# EasyEDA Pro project ProProject_阵列式磁场检测仪_2024-06-02.epro, schematic Schematic2

## Sheets
1 P1: Create Date: 2024-04-23; Page Name: P1; Project Name: 阵列式磁场检测仪; Schematic Name: Schematic2; Update Date: 2024-04-23; Company: 嘉立创EDA; Page Size: A4; Version: V1.0
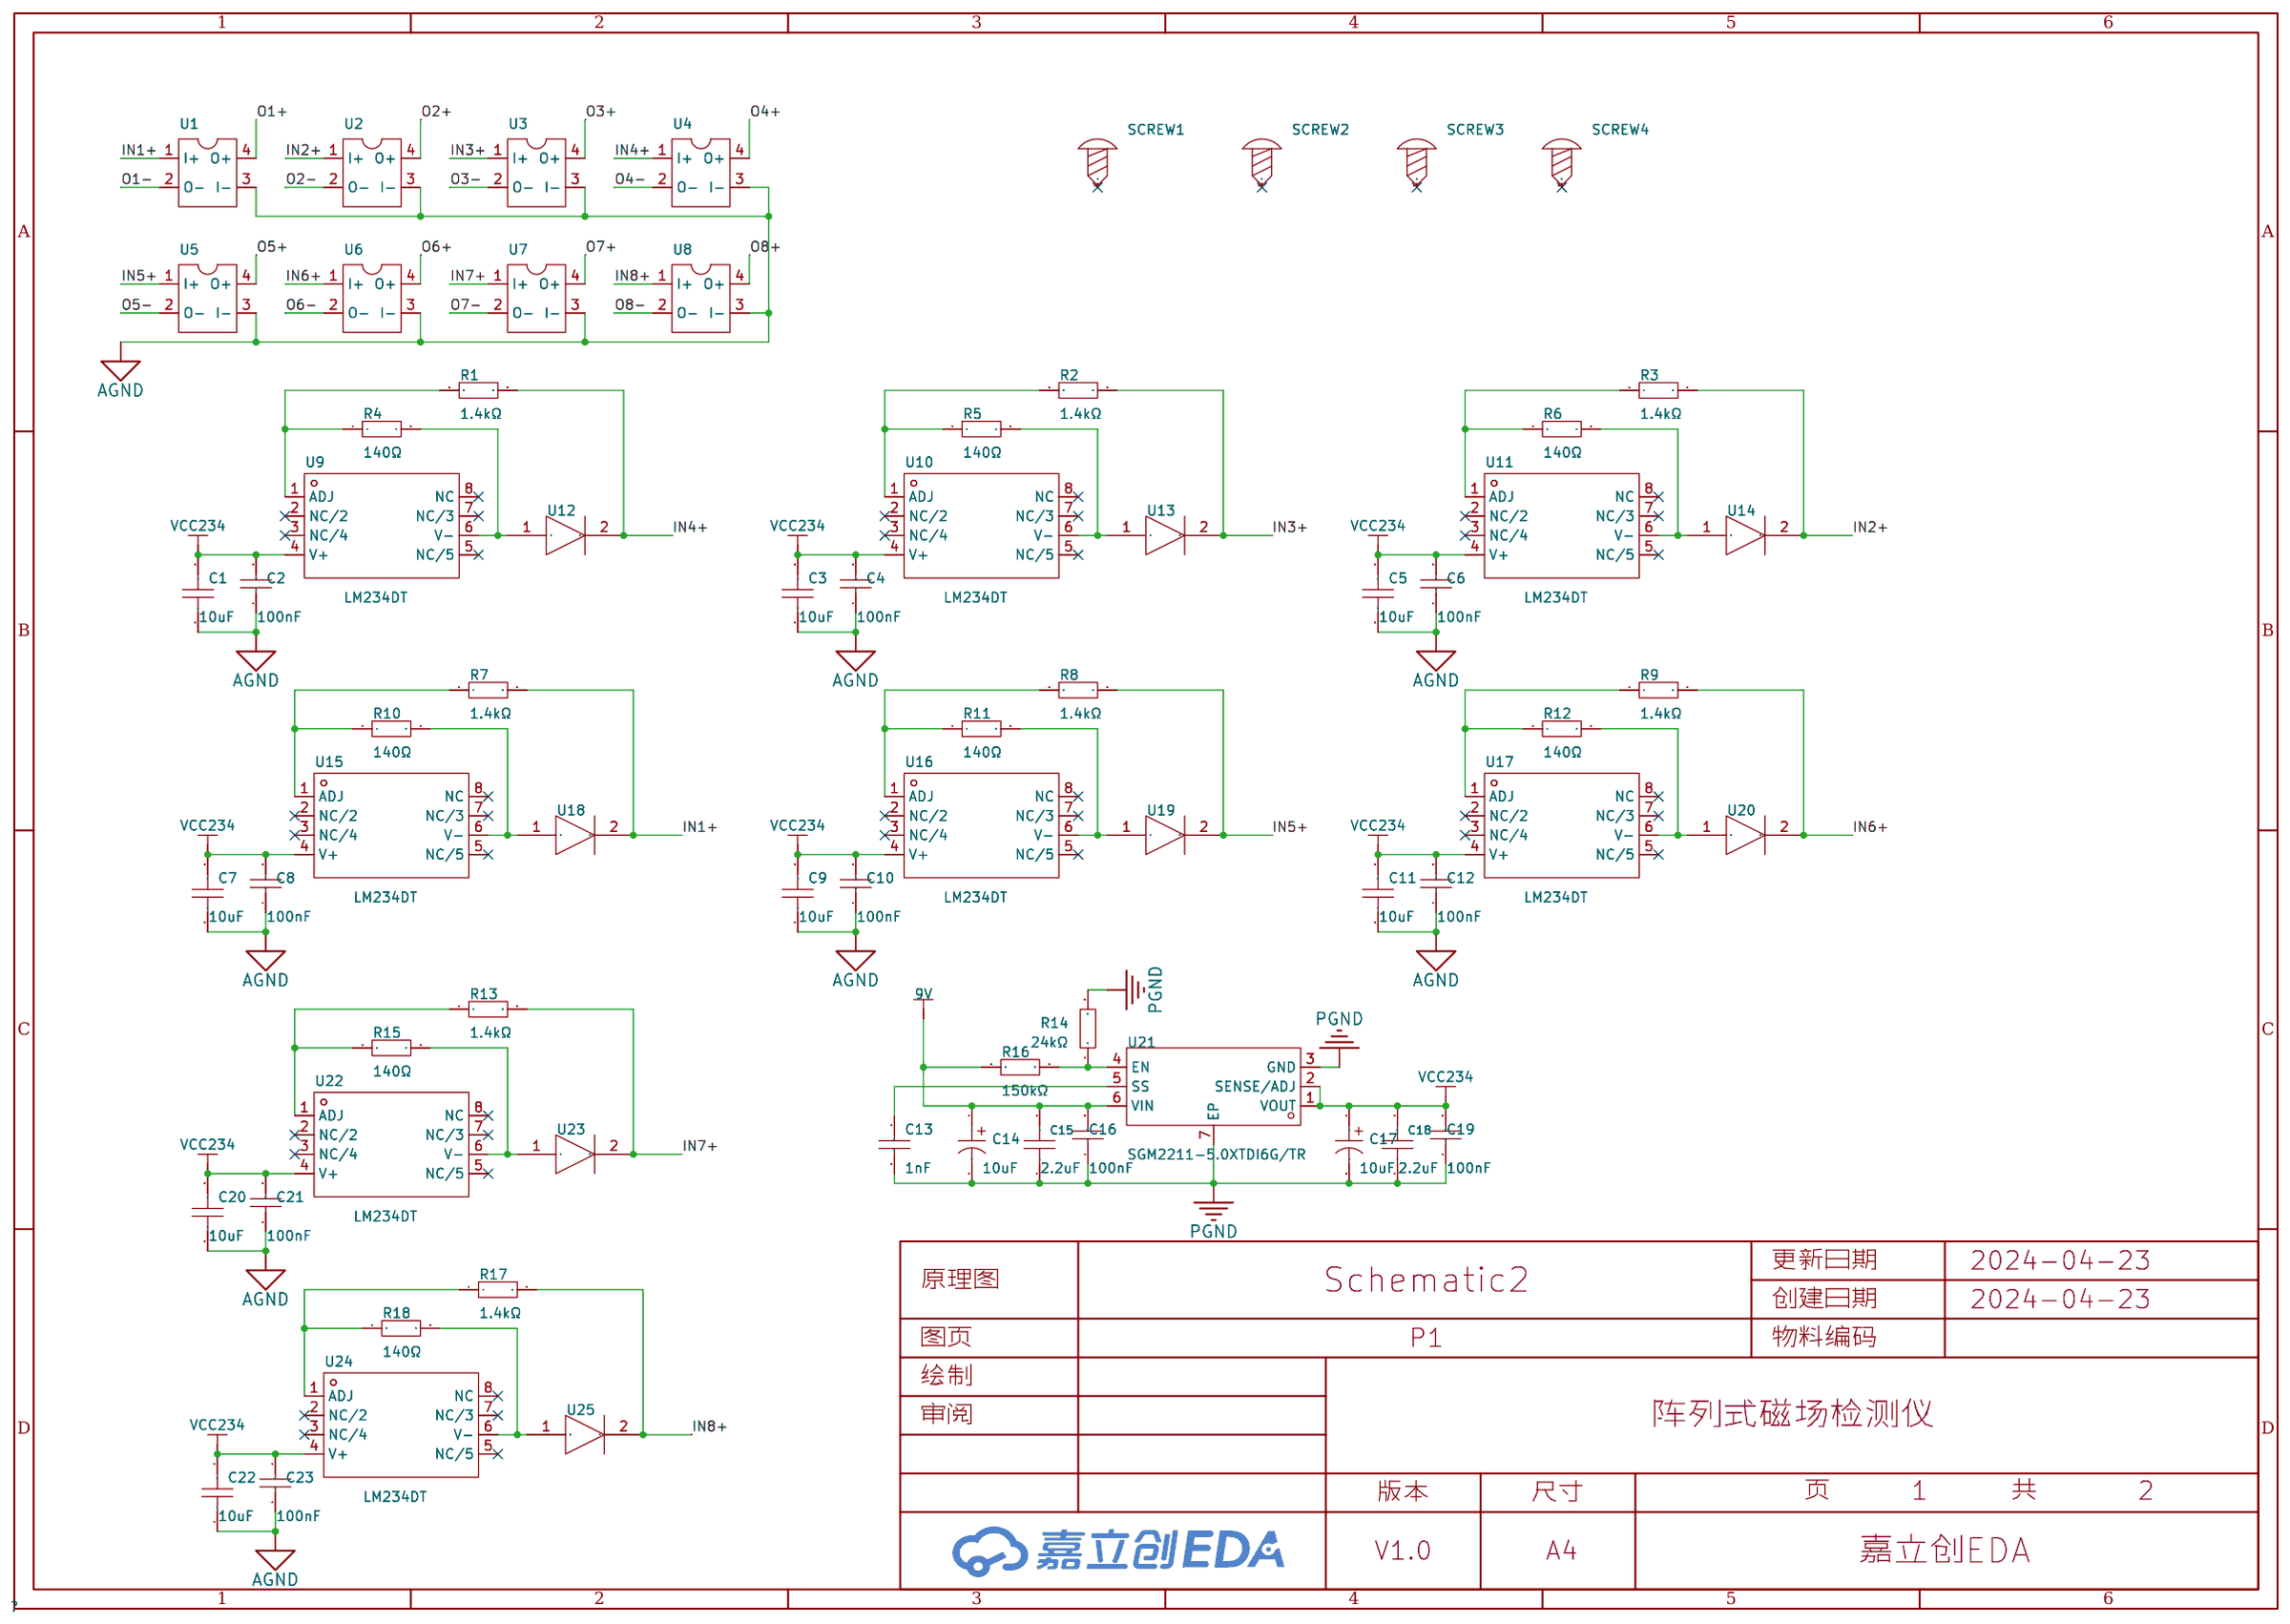
[diagram p1: P1]
2 P2: Page Name: P2
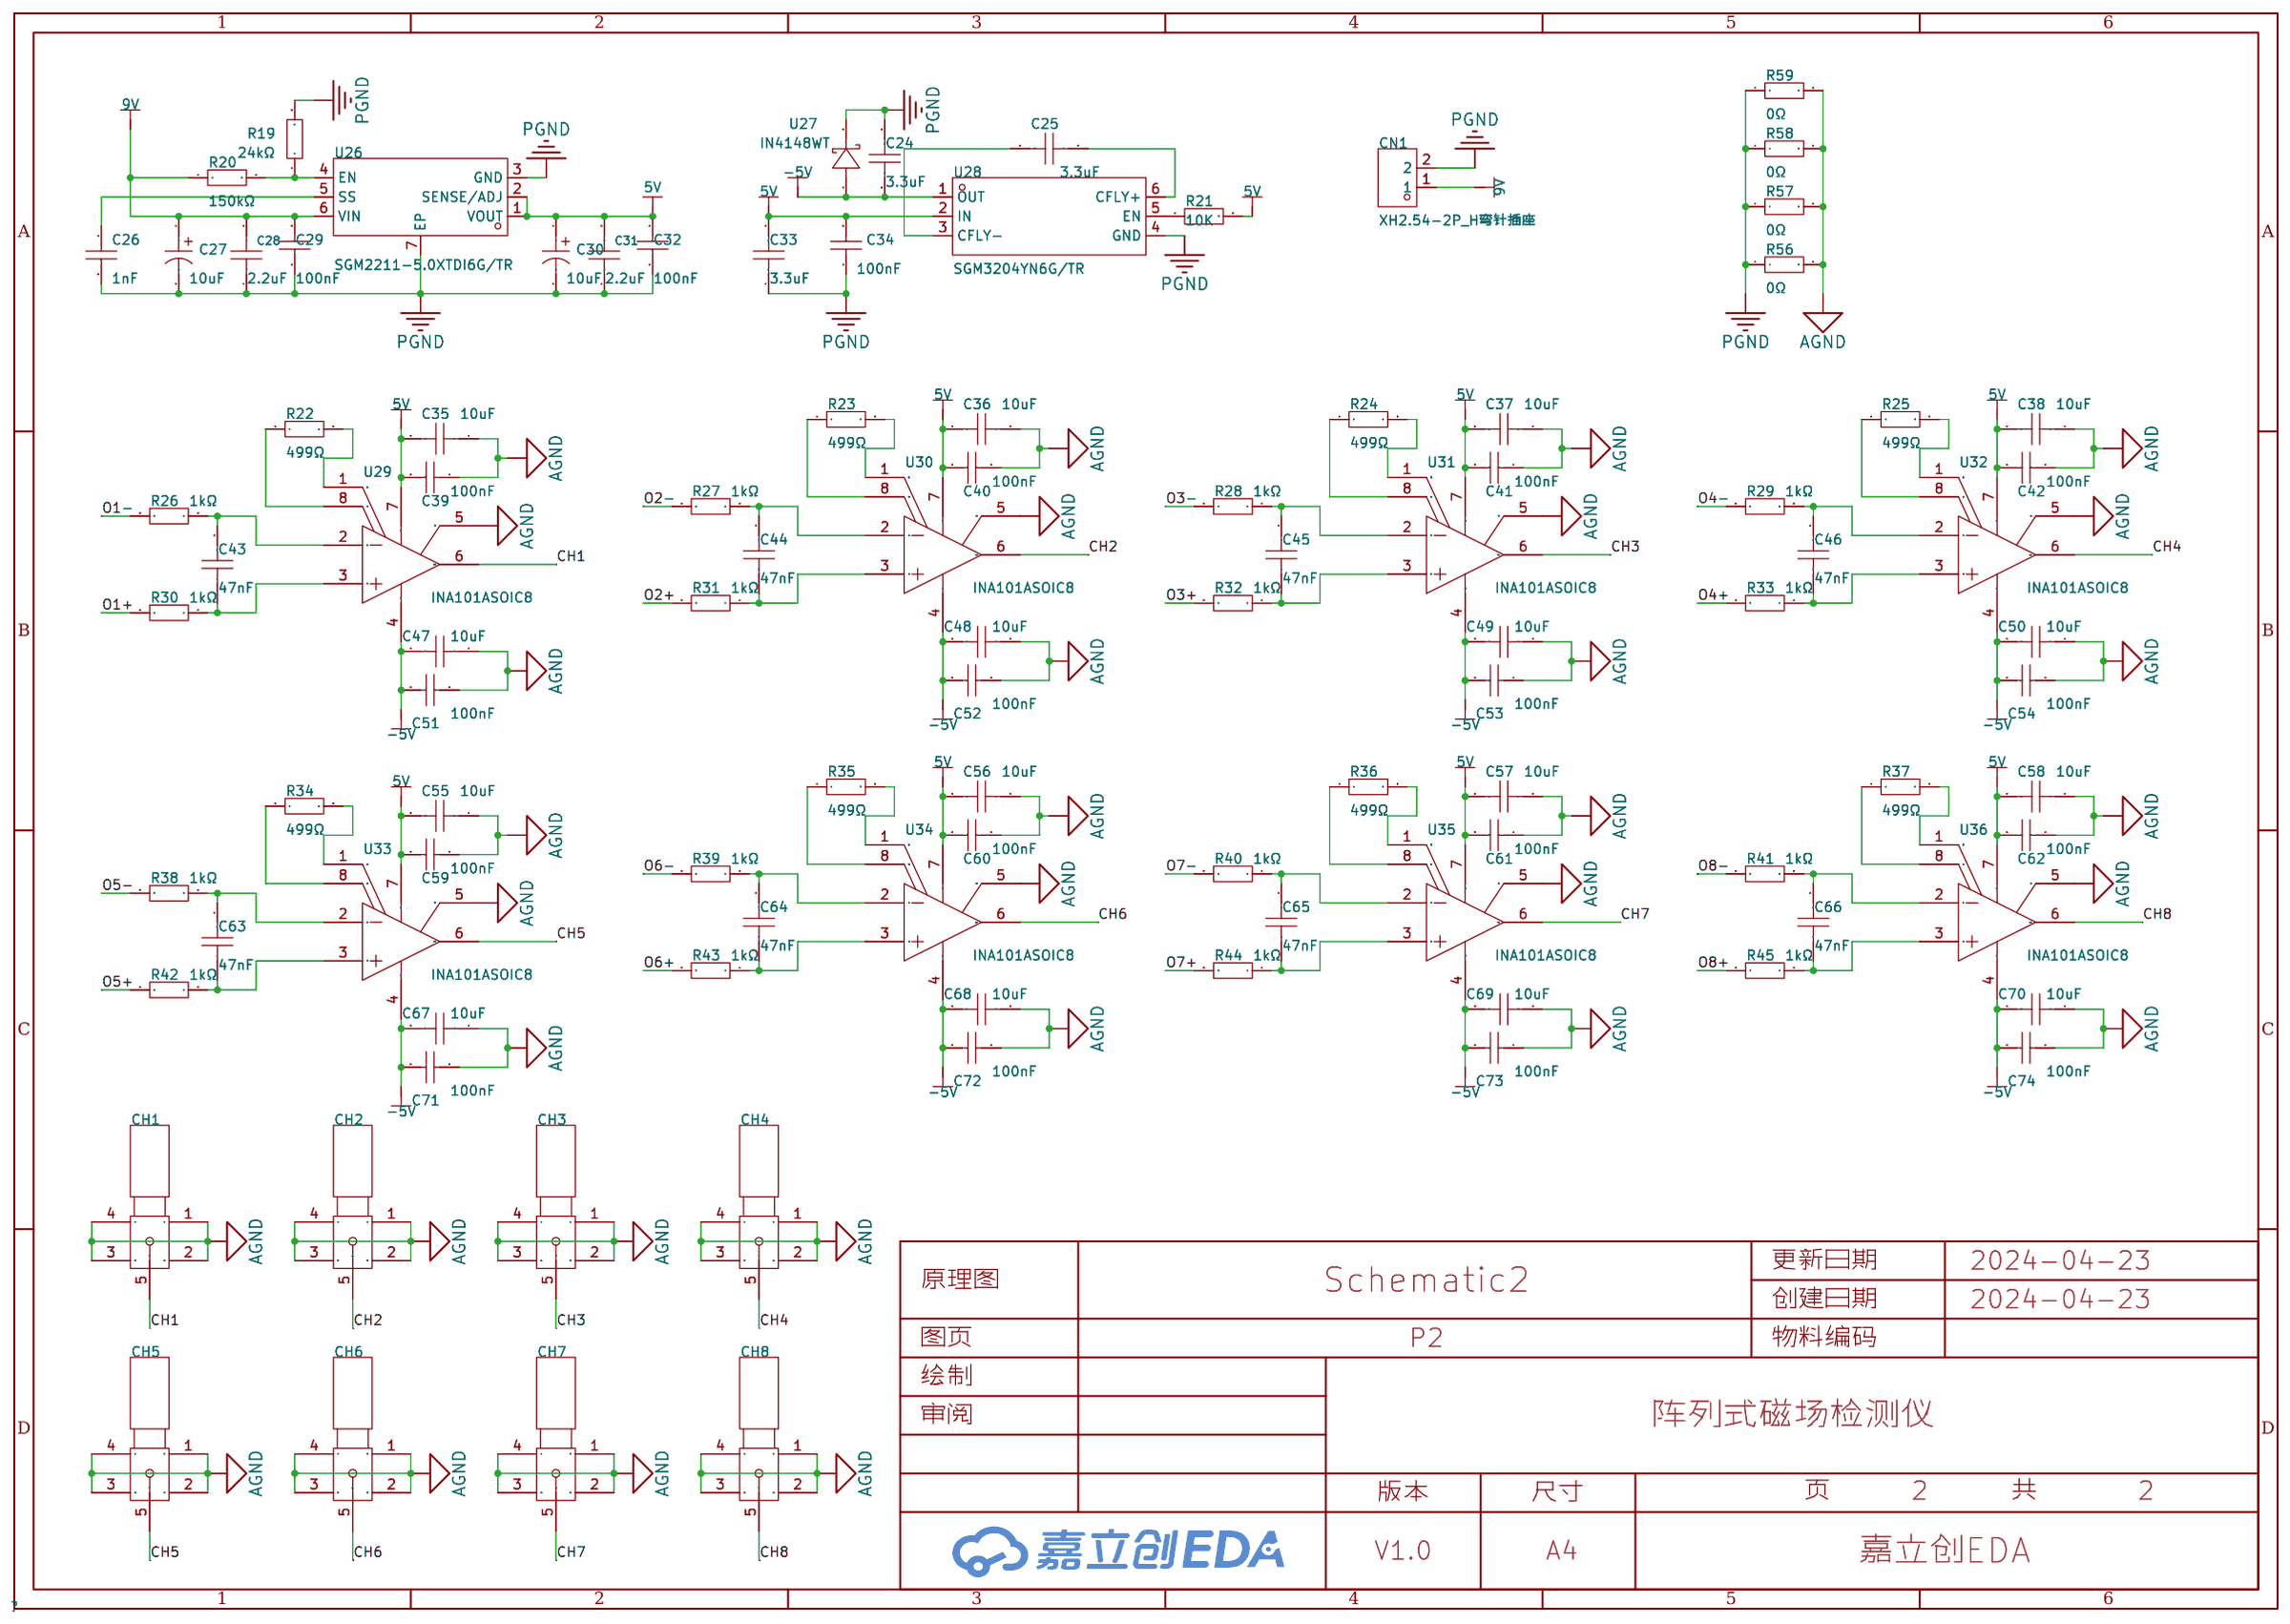
[diagram p2: P2]

## Parts
sheet P1
C1  10uF  [C0805]
C2  100nF  [C0603]
C3  10uF  [C0805]
C4  100nF  [C0603]
C5  10uF  [C0805]
C6  100nF  [C0603]
C7  10uF  [C0805]
C8  100nF  [C0603]
C9  10uF  [C0805]
C10  100nF  [C0603]
C11  10uF  [C0805]
C12  100nF  [C0603]
C13  1nF  [C0603]
C14  10uF  [CAP-SMD_BD5.0-L5.3-W5.3-FD]
C15  2.2uF  [C0603]
C16  100nF  [C0603]
C17  10uF  [CAP-SMD_BD5.0-L5.3-W5.3-FD]
C18  2.2uF  [C0603]
C19  100nF  [C0603]
C20  10uF  [C0805]
C21  100nF  [C0603]
C22  10uF  [C0805]
C23  100nF  [C0603]
R1  1.4kΩ  [R0603]
R2  1.4kΩ  [R0603]
R3  1.4kΩ  [R0603]
R4  140Ω  [R0603]
R5  140Ω  [R0603]
R6  140Ω  [R0603]
R7  1.4kΩ  [R0603]
R8  1.4kΩ  [R0603]
R9  1.4kΩ  [R0603]
R10  140Ω  [R0603]
R11  140Ω  [R0603]
R12  140Ω  [R0603]
R13  1.4kΩ  [R0603]
R14  24kΩ  [R0603]
R15  140Ω  [R0603]
R16  150kΩ  [R0603]
R17  1.4kΩ  [R0603]
R18  140Ω  [R0603]
SCREW1  -  [M3螺丝]
SCREW2  -  [M3螺丝]
SCREW3  -  [M3螺丝]
SCREW4  -  [M3螺丝]
U1  -  [HALL]
U2  -  [HALL]
U3  -  [HALL]
U4  -  [HALL]
U5  -  [HALL]
U6  -  [HALL]
U7  -  [HALL]
U8  -  [HALL]
U9  LM234DT  [SOIC-8_L4.9-W3.9-P1.27-LS6.0-BL]
U10  LM234DT  [SOIC-8_L4.9-W3.9-P1.27-LS6.0-BL]
U11  LM234DT  [SOIC-8_L4.9-W3.9-P1.27-LS6.0-BL]
U12  -  [IN457]
U13  -  [IN457]
U14  -  [IN457]
U15  LM234DT  [SOIC-8_L4.9-W3.9-P1.27-LS6.0-BL]
U16  LM234DT  [SOIC-8_L4.9-W3.9-P1.27-LS6.0-BL]
U17  LM234DT  [SOIC-8_L4.9-W3.9-P1.27-LS6.0-BL]
U18  -  [IN457]
U19  -  [IN457]
U20  -  [IN457]
U21  SGM2211-5.0XTDI6G/TR  [TDFN-6_L2.0-W2.0-P0.65-BL-EP]
U22  LM234DT  [SOIC-8_L4.9-W3.9-P1.27-LS6.0-BL]
U23  -  [IN457]
U24  LM234DT  [SOIC-8_L4.9-W3.9-P1.27-LS6.0-BL]
U25  -  [IN457]
sheet P2
C24  3.3uF  [C0603]
C25  3.3uF  [C0603]
C26  1nF  [C0603]
C27  10uF  [CAP-SMD_BD5.0-L5.3-W5.3-FD]
C28  2.2uF  [C0603]
C29  100nF  [C0603]
C30  10uF  [CAP-SMD_BD5.0-L5.3-W5.3-FD]
C31  2.2uF  [C0603]
C32  100nF  [C0603]
C33  3.3uF  [C0603]
C34  100nF  [C0603]
C35  10uF  [C0805]
C36  10uF  [C0805]
C37  10uF  [C0805]
C38  10uF  [C0805]
C39  100nF  [C0603]
C40  100nF  [C0603]
C41  100nF  [C0603]
C42  100nF  [C0603]
C43  47nF  [C0603]
C44  47nF  [C0603]
C45  47nF  [C0603]
C46  47nF  [C0603]
C47  10uF  [C0805]
C48  10uF  [C0805]
C49  10uF  [C0805]
C50  10uF  [C0805]
C51  100nF  [C0603]
C52  100nF  [C0603]
C53  100nF  [C0603]
C54  100nF  [C0603]
C55  10uF  [C0805]
C56  10uF  [C0805]
C57  10uF  [C0805]
C58  10uF  [C0805]
C59  100nF  [C0603]
C60  100nF  [C0603]
C61  100nF  [C0603]
C62  100nF  [C0603]
C63  47nF  [C0603]
C64  47nF  [C0603]
C65  47nF  [C0603]
C66  47nF  [C0603]
C67  10uF  [C0805]
C68  10uF  [C0805]
C69  10uF  [C0805]
C70  10uF  [C0805]
C71  100nF  [C0603]
C72  100nF  [C0603]
C73  100nF  [C0603]
C74  100nF  [C0603]
CH1  BWSMA-KWE-Z001  [SMA-TH_BWSMA-KWE-Z001]
CH2  BWSMA-KWE-Z001  [SMA-TH_BWSMA-KWE-Z001]
CH3  BWSMA-KWE-Z001  [SMA-TH_BWSMA-KWE-Z001]
CH4  BWSMA-KWE-Z001  [SMA-TH_BWSMA-KWE-Z001]
CH5  BWSMA-KWE-Z001  [SMA-TH_BWSMA-KWE-Z001]
CH6  BWSMA-KWE-Z001  [SMA-TH_BWSMA-KWE-Z001]
CH7  BWSMA-KWE-Z001  [SMA-TH_BWSMA-KWE-Z001]
CH8  BWSMA-KWE-Z001  [SMA-TH_BWSMA-KWE-Z001]
CN1  XH2.54-2P_H弯针插座  [CONN-TH_2P-P2.5_XH2.54-2P_H]
R19  24kΩ  [R0603]
R20  150kΩ  [R0603]
R21  10K  [R0603]
R22  499Ω  [R0603]
R23  499Ω  [R0603]
R24  499Ω  [R0603]
R25  499Ω  [R0603]
R26  1kΩ  [R0603]
R27  1kΩ  [R0603]
R28  1kΩ  [R0603]
R29  1kΩ  [R0603]
R30  1kΩ  [R0603]
R31  1kΩ  [R0603]
R32  1kΩ  [R0603]
R33  1kΩ  [R0603]
R34  499Ω  [R0603]
R35  499Ω  [R0603]
R36  499Ω  [R0603]
R37  499Ω  [R0603]
R38  1kΩ  [R0603]
R39  1kΩ  [R0603]
R40  1kΩ  [R0603]
R41  1kΩ  [R0603]
R42  1kΩ  [R0603]
R43  1kΩ  [R0603]
R44  1kΩ  [R0603]
R45  1kΩ  [R0603]
R56  0Ω  [R1206]
R57  0Ω  [R1206]
R58  0Ω  [R1206]
R59  0Ω  [R1206]
U26  SGM2211-5.0XTDI6G/TR  [TDFN-6_L2.0-W2.0-P0.65-BL-EP]
U27  IN4148WT  [SOD-523_L1.2-W0.8-LS1.6-FD]
U28  SGM3204YN6G/TR  [SOT-23-6_L2.9-W1.6-P0.95-LS2.8-BR]
U29  INA101ASOIC8  [SOIC-8_L4.9-W3.9-P1.27-LS6.0-BL]
U30  INA101ASOIC8  [SOIC-8_L4.9-W3.9-P1.27-LS6.0-BL]
U31  INA101ASOIC8  [SOIC-8_L4.9-W3.9-P1.27-LS6.0-BL]
U32  INA101ASOIC8  [SOIC-8_L4.9-W3.9-P1.27-LS6.0-BL]
U33  INA101ASOIC8  [SOIC-8_L4.9-W3.9-P1.27-LS6.0-BL]
U34  INA101ASOIC8  [SOIC-8_L4.9-W3.9-P1.27-LS6.0-BL]
U35  INA101ASOIC8  [SOIC-8_L4.9-W3.9-P1.27-LS6.0-BL]
U36  INA101ASOIC8  [SOIC-8_L4.9-W3.9-P1.27-LS6.0-BL]

## Library data of the parts
C1 C3 C5 C7 C9 C11 C20 C22 C35-C38 C47-C50 C55-C58 C67-C70 = CL21A106KAYNNNE_C15850: 容值:10uF;精度:±10%;额定电压:25V;材质(温度系数):X5R;; LCSC Part Name: 10uF ±10% 25V; Supplier Part: C15850; Manufacturer: SAMSUNG(三星); Manufacturer Part: CL21A106KAYNNNE; Supplier Footprint: 0805; Datasheet: https://atta.szlcsc.com/upload/public/pdf/source/20160218/1457707763339.pdf; Supplier: LCSC; Tolerance: ±10%; Voltage Rated: 25V; Temperature Coefficient: X5R
C2 C4 C6 C8 C10 C12 C16 C19 C21 C23 C29 C32 C34 C39-C42 C51-C54 C59-C62 C71-C74 = 0603B104K500NT: 容值:100nF;精度:±10%;额定电压:50V;材质(温度系数):X7R;; LCSC Part Name: 100nF ±10% 50V; Supplier Part: C30926; Manufacturer: FH(风华); Supplier Footprint: 0603; Datasheet: https://atta.szlcsc.com/upload/public/pdf/source/20200305/C486355_26A10D38EF8C2A5C37091D0039909270.pdf; Supplier: LCSC; Tolerance: ±10%; Voltage Rated: 50V; Temperature Coefficient: X7R
C13 C26 = CC0603KRX7R9BB102: 容值:1nF;精度:±10%;额定电压:50V;材质(温度系数):X7R;; LCSC Part Name: 1nF ±10% 50V; Supplier Part: C100040; Manufacturer: YAGEO(国巨); Supplier Footprint: 0603; Datasheet: https://atta.szlcsc.com/upload/public/pdf/source/20180910/C282072_33301C7F631E79921B82A8DAC6BCC5B3.pdf; Supplier: LCSC; Tolerance: ±10%; Voltage Rated: 50V; Temperature Coefficient: X7R
C14 C17 C27 C30 = RST10UF50V016: 容值:10uF;精度:±20%;额定电压:50V;纹波电流:24mA@120Hz;等效串联电阻:-;; LCSC Part Name: 10uF ±20% 50V; Supplier Part: C4747971; Manufacturer: KNSCHA(科尼盛); Supplier Footprint: SMD,D5xL5.4mm; Datasheet: https://atta.szlcsc.com/upload/public/pdf/source/20220722/47144637C831FC4476CE4962252D8002.pdf; Supplier: LCSC; Tolerance: ±20%; Rated Voltage: 50V; Ripple Current: 24mA@120Hz; φD: 5mm; L: 5.4mm; Lifetime @ Temp: 2000hrs@105℃; Operating Temperature: -40℃~+105℃
C15 C18 C28 C31 = CL10A225KB8NNNC: 容值:2.2uF;精度:±10%;额定电压:50V;材质(温度系数):X5R;; LCSC Part Name: 2.2uF ±10% 50V; Supplier Part: C913904; Manufacturer: SAMSUNG(三星); Supplier Footprint: 0603; Datasheet: https://atta.szlcsc.com/upload/public/pdf/source/20160218/1457707763339.pdf; Supplier: LCSC; Tolerance: ±10%; Voltage Rated: 50V; Temperature Coefficient: X5R
R1-R3 R7-R9 R13 R17 = RT0603BRE071K4L: 电阻类型:薄膜电阻;阻值:1.4kΩ;精度:±0.1%;功率:100mW;最大工作电压:75V;温度系数:±50ppm/℃;; LCSC Part Name: 薄膜电阻 1.4kΩ ±0.1% 100mW; Supplier Part: C136956; Manufacturer: YAGEO(国巨); Supplier Footprint: 0603; Datasheet: https://atta.szlcsc.com/upload/public/pdf/source/20180126/C179820_15169519410631308743.pdf; Supplier: LCSC; Type: 薄膜电阻; Tolerance: ±0.1%; Power(Watts): 100mW; Overload Voltage (Max): 75V; Temperature Coefficient: ±50ppm/℃; Operating Temperature Range: -55℃~+155℃
R4-R6 R10-R12 R15 R18 = TR0603D140RP0525Z: 电阻类型:薄膜电阻;阻值:140Ω;精度:±0.5%;功率:100mW;最大工作电压:75V;温度系数:±25ppm/℃;; LCSC Part Name: 薄膜电阻 140Ω ±0.5% 100mW; Supplier Part: C149942; Manufacturer: EVER OHMS(天二科技); Supplier Footprint: 0603; Datasheet: https://atta.szlcsc.com/upload/public/pdf/source/20190918/C429510_4513AD098FCD1E1EB01EBF3597E9489F.pdf; Supplier: LCSC; Type: 薄膜电阻; Tolerance: ±0.5%; Power(Watts): 100mW; Overload Voltage (Max): 75V; Temperature Coefficient: ±25ppm/℃; Operating Temperature Range: -55℃~+155℃
R14 R19 = 0603WAF2402T5E: 电阻类型:厚膜电阻;阻值:24kΩ;精度:±1%;功率:100mW;最大工作电压:75V;温度系数:±100ppm/℃;; LCSC Part Name: 24kΩ ±1% 100mW 厚膜电阻; Supplier Part: C23352; Manufacturer: UNI-ROYAL(厚声); Supplier Footprint: 0603; JLCPCB Part Class: 基础库; Datasheet: https://atta.szlcsc.com/upload/public/pdf/source/20200306/C422600_1E6D84923E4A46A82E41ADD87F860B5C.pdf; Supplier: LCSC; Type: 厚膜电阻; Tolerance: ±1%; Power(Watts): 100mW; Overload Voltage (Max): 75V; Temperature Coefficient: ±100ppm/℃; Operating Temperature Range: -55℃~+155℃
R16 R20 = 0603WAF1503T5E: 电阻类型:厚膜电阻;阻值:150kΩ;精度:±1%;功率:100mW;最大工作电压:75V;温度系数:±100ppm/℃;; LCSC Part Name: 150kΩ ±1% 100mW 厚膜电阻; Supplier Part: C22807; Manufacturer: UNI-ROYAL(厚声); Supplier Footprint: 0603; JLCPCB Part Class: 基础库; Datasheet: https://atta.szlcsc.com/upload/public/pdf/source/20200306/C422600_1E6D84923E4A46A82E41ADD87F860B5C.pdf; Supplier: LCSC; Type: 厚膜电阻; Tolerance: ±1%; Power(Watts): 100mW; Overload Voltage (Max): 75V; Temperature Coefficient: ±100ppm/℃; Operating Temperature Range: -55℃~+155℃
SCREW1-SCREW4 = M3螺丝: Supplier Footprint: 插件
U1-U8 = HALL
U9-U11 U15-U17 U22 U24 = LM234DT: 工作电压:1V~40V;输出电流:10mA;精度:±3%;; LCSC Part Name: 10mA 电流源 40V; Supplier Part: C157402; Manufacturer: ST(意法半导体); Supplier Footprint: SOIC-8; Datasheet: https://atta.szlcsc.com/upload/public/pdf/source/20180125/C157402_15168648817961302756.pdf; Supplier: LCSC; Type: 电流源; Supply Voltage: 1V~40V; Output Current: 10mA; Tolerance: ±3%; Operating Temperature: -25℃~+100℃
U12-U14 U18-U20 U23 U25 = IN457
U21 U26 = SGM2211-1.8XTDI6G/TR: Supplier Part: C5152834; Manufacturer: SGMICRO(圣邦微); Supplier Footprint: TDFN-6AL(2x2); JLCPCB Part Class: 扩展库; Datasheet: https://atta.szlcsc.com/upload/public/pdf/source/20220928/26A0674FCF0885761ED3B533E1830369.pdf; Supplier: LCSC
C24 C25 C33 = C1608X5R1E335KT000E: 容值:3.3uF;精度:±10%;额定电压:25V;材质(温度系数):X5R;; LCSC Part Name: 3.3uF ±10% 25V; Supplier Part: C342962; Manufacturer: TDK; Supplier Footprint: 0603; Datasheet: https://atta.szlcsc.com/upload/public/pdf/source/20190612/C361180_85CC9FB0751BEA97238DE56AB4AF0B1F.pdf; Supplier: LCSC; Tolerance: ±10%; Voltage Rated: 25V; Temperature Coefficient: X5R
C43-C46 C63-C66 = 0603B473K500NT: 容值:47nF;精度:±10%;额定电压:50V;材质(温度系数):X7R;; LCSC Part Name: 47nF ±10% 50V; Supplier Part: C285123; Manufacturer: FH(风华); Supplier Footprint: 0603; JLCPCB Part Class: 扩展库; Datasheet: https://atta.szlcsc.com/upload/public/pdf/source/20200305/C486355_26A10D38EF8C2A5C37091D0039909270.pdf; Supplier: LCSC; Tolerance: ±10%; Voltage Rated: 50V; Temperature Coefficient: X7R
CH1-CH8 = BWSMA-KWE-Z001: 连接器类型:板端;接口类型:内孔;端口数量:1;接口直径:5.3mm;接口长度/高度:-;频率-最大值:-;射频系列:SMA;阻抗:50Ω;样式:弯头;触头材质:-;触头镀层:-;工作温度范围:-;焊接温度(最大值):-;; LCSC Part Name: 内孔 SMA 弯头; Supplier Part: C496551; Manufacturer: BAT WIRELESS(蝙蝠无线); Supplier Footprint: 插件; Datasheet: https://atta.szlcsc.com/upload/public/pdf/source/20231017/997A8C2ADA7F8034A89BE1264F38CE52.pdf; Supplier: LCSC; Connector Type: 板端; Interface Type: 内孔; Number of Ports: 1; Interface Diameter: 5.3mm; RF Series: SMA; Impedance: 50Ω; Style: 弯头
CN1 = XH2.54-2P_H弯针插座: Supplier Part: C2915111; Supplier Footprint: TH-2P; JLCPCB Part Class: 扩展库; Supplier: LCSC
R21 = Res_0603: Supplier Footprint: 0603
R22-R25 R34-R37 = 0603WAF4990T5E: 电阻类型:厚膜电阻;阻值:499Ω;精度:±1%;功率:100mW;最大工作电压:75V;温度系数:±100ppm/℃;; LCSC Part Name: 499Ω ±1% 100mW 厚膜电阻; Supplier Part: C23065; Manufacturer: UNI-ROYAL(厚声); Supplier Footprint: 0603; Datasheet: https://atta.szlcsc.com/upload/public/pdf/source/20200306/C422600_1E6D84923E4A46A82E41ADD87F860B5C.pdf; Supplier: LCSC; Type: 厚膜电阻; Tolerance: ±1%; Power(Watts): 100mW; Overload Voltage (Max): 75V; Temperature Coefficient: ±100ppm/℃; Operating Temperature Range: -55℃~+155℃
R26-R33 R38-R45 = 0603WAF1001T5E: 电阻类型:厚膜电阻;阻值:1kΩ;精度:±1%;功率:100mW;最大工作电压:75V;温度系数:±100ppm/℃;; LCSC Part Name: 1kΩ ±1% 100mW 厚膜电阻; Supplier Part: C21190; Manufacturer: UNI-ROYAL(厚声); Supplier Footprint: 0603; Datasheet: https://atta.szlcsc.com/upload/public/pdf/source/20200306/C422600_1E6D84923E4A46A82E41ADD87F860B5C.pdf; Supplier: LCSC; Type: 厚膜电阻; Tolerance: ±1%; Power(Watts): 100mW; Overload Voltage (Max): 75V; Temperature Coefficient: ±100ppm/℃; Operating Temperature Range: -55℃~+155℃
R56-R59 = 1206W4F0000T5E: 电阻类型:厚膜电阻;阻值:0Ω;精度:±1%;功率:250mW;最大工作电压:200V;温度系数:±800ppm/℃;; LCSC Part Name: 0Ω ±1% 250mW 厚膜电阻; Supplier Part: C17888; Manufacturer: UNI-ROYAL(厚声); Supplier Footprint: 1206; JLCPCB Part Class: 基础库; Datasheet: https://atta.szlcsc.com/upload/public/pdf/source/20200306/C422600_1E6D84923E4A46A82E41ADD87F860B5C.pdf; Supplier: LCSC; Type: 厚膜电阻; Tolerance: ±1%; Power(Watts): 250mW; Overload Voltage (Max): 200V; Temperature Coefficient: ±800ppm/℃; Operating Temperature Range: -55℃~+155℃
U27 = IN4148WT: Supplier Part: C9900015724; Supplier Footprint: DIODEGENPURP100V150MASOD-523; JLCPCB Part Class: 扩展库; Supplier: LCSC
U28 = SGM3204YN6G/TR: 功能类型:-;输入电压:1.4V~5.5V;输出电压:-5.5V~-1.4V;输出电流(最大值):200mA;; Supplier Part: C194031; Manufacturer: SGMICRO(圣邦微); Supplier Footprint: SOT-23-6; Datasheet: https://atta.szlcsc.com/upload/public/pdf/source/20180627/C194031_755051E53122D645C36CF727711B963E.pdf; Supplier: LCSC; Input Voltage: 1.4V~5.5V; Output Voltage: -5.5V~-1.4V; Output Current (Max): 200mA; Switching Frequency: 950kHz; Number of Outputs: 1; Switch tube (built-in/external): 内置
U29-U36 = INA101ASOIC8: 放大器数:-;共模抑制比(CMRR):104dB;输入偏置电流(Ib):1nA;输入失调电压(Vos):2.5uV;增益带宽积(GBP):-;压摆率(SR):-;带宽(-3db):1.3MHz;轨到轨:-;; LCSC Part Name: 线性产品; Supplier Part: C5359442; Manufacturer: analogysemi(类比半导体); Supplier Footprint: SOIC-8; JLCPCB Part Class: 扩展库; Datasheet: https://atta.szlcsc.com/upload/public/pdf/source/20230221/88ECF15C5A4D3235CE0DAFCB201D4D48.pdf; Supplier: LCSC; Common Mode Rejection Ratio (CMRR): 104dB; Current - Input Bias(Ib): 1nA; Voltage - Input Offset(Vos): 2.5uV; Supply Voltage: 4V~38V; -3db Bandwidth: 1.3MHz; Supply Current: 1.56mA; Input Offset Voltage Drift (Vos TC): 0.02uV/°C; Operating Temperature: -55℃~+125℃

## Nets
5V: C30.1 C31.2 C32.2 C33.2 C34.2 C35.2 C36.2 C37.2 C38.2 C39.2 C40.2 C41.2 C42.2 C55.2 C56.2 C57.2 C58.2 C59.2 C60.2 C61.2 C62.2 R21.2 U26.1(VOUT) U26.2(SENSE/ADJ) U28.2(IN) U29.7(+VS) U30.7(+VS) U31.7(+VS) U32.7(+VS) U33.7(+VS) U34.7(+VS) U35.7(+VS) U36.7(+VS)
9V: C14.1 C15.2 C16.2 C27.1 C28.2 C29.2 CN1.1 R16.1 R20.1 U21.6(VIN) U26.6(VIN)
-5V: C24.2 C47.2 C48.2 C49.2 C50.2 C51.2 C52.2 C53.2 C54.2 C67.2 C68.2 C69.2 C70.2 C71.2 C72.2 C73.2 C74.2 U27.1(A) U28.1(OUT) U29.4(–VS) U30.4(–VS) U31.4(–VS) U32.4(–VS) U33.4(–VS) U34.4(–VS) U35.4(–VS) U36.4(–VS)
AGND: C1.1 C2.1 C3.1 C4.1 C5.1 C6.1 C7.1 C8.1 C9.1 C10.1 C11.1 C12.1 C20.1 C21.1 C22.1 C23.1 C35.1 C36.1 C37.1 C38.1 C39.1 C40.1 C41.1 C42.1 C47.1 C48.1 C49.1 C50.1 C51.1 C52.1 C53.1 C54.1 C55.1 C56.1 C57.1 C58.1 C59.1 C60.1 C61.1 C62.1 C67.1 C68.1 C69.1 C70.1 C71.1 C72.1 C73.1 C74.1 CH1.1 CH1.2 CH1.3 CH1.4 CH2.1 CH2.2 CH2.3 CH2.4 CH3.1 CH3.2 CH3.3 CH3.4 CH4.1 CH4.2 CH4.3 CH4.4 CH5.1 CH5.2 CH5.3 CH5.4 CH6.1 CH6.2 CH6.3 CH6.4 CH7.1 CH7.2 CH7.3 CH7.4 CH8.1 CH8.2 CH8.3 CH8.4 R56.2 R57.2 R58.2 R59.2 U1.3(I-) U2.3(I-) U3.3(I-) U4.3(I-) U5.3(I-) U6.3(I-) U7.3(I-) U8.3(I-) U29.5(REF) U30.5(REF) U31.5(REF) U32.5(REF) U33.5(REF) U34.5(REF) U35.5(REF) U36.5(REF)
PGND: C13.2 C14.2 C15.1 C16.1 C17.2 C18.1 C19.1 C24.1 C26.2 C27.2 C28.1 C29.1 C30.2 C31.1 C32.1 C33.1 C34.1 CN1.2 R14.2 R19.2 R56.1 R57.1 R58.1 R59.1 U21.3(GND) U21.7(EP) U26.3(GND) U26.7(EP) U27.2(K) U28.4(GND)
VCC234: C1.2 C2.2 C3.2 C4.2 C5.2 C6.2 C7.2 C8.2 C9.2 C10.2 C11.2 C12.2 C17.1 C18.2 C19.2 C20.2 C21.2 C22.2 C23.2 U9.4(V+) U10.4(V+) U11.4(V+) U15.4(V+) U16.4(V+) U17.4(V+) U21.1(VOUT) U21.2(SENSE/ADJ) U22.4(V+) U24.4(V+)
CH1: CH1.5 U29.6(OUTPUT)
CH2: CH2.5 U30.6(OUTPUT)
CH3: CH3.5 U31.6(OUTPUT)
CH4: CH4.5 U32.6(OUTPUT)
CH5: CH5.5 U33.6(OUTPUT)
CH6: CH6.5 U34.6(OUTPUT)
CH7: CH7.5 U35.6(OUTPUT)
CH8: CH8.5 U36.6(OUTPUT)
IN1+: R7.2 U1.1(I+) U18.2
IN2+: R3.2 U2.1(I+) U14.2
IN3+: R2.2 U3.1(I+) U13.2
IN4+: R1.2 U4.1(I+) U12.2
IN5+: R8.2 U5.1(I+) U19.2
IN6+: R9.2 U6.1(I+) U20.2
IN7+: R13.2 U7.1(I+) U23.2
IN8+: R17.2 U8.1(I+) U25.2
O1+: R30.2 U1.4(O+)
O1-: R26.2 U1.2(O-)
O2+: R31.2 U2.4(O+)
O2-: R27.2 U2.2(O-)
O3+: R32.2 U3.4(O+)
O3-: R28.2 U3.2(O-)
O4+: R33.2 U4.4(O+)
O4-: R29.2 U4.2(O-)
O5+: R42.2 U5.4(O+)
O5-: R38.2 U5.2(O-)
O6+: R43.2 U6.4(O+)
O6-: R39.2 U6.2(O-)
O7+: R44.2 U7.4(O+)
O7-: R40.2 U7.2(O-)
O8+: R45.2 U8.4(O+)
O8-: R41.2 U8.2(O-)
$1N532: R4.2 U9.6(V-) U12.1
$1N533: R1.1 R4.1 U9.1(ADJ)
$1N783: R10.2 U15.6(V-) U18.1
$1N784: R7.1 R10.1 U15.1(ADJ)
$1N1034: R15.2 U22.6(V-) U23.1
$1N1035: R13.1 R15.1 U22.1(ADJ)
$1N1285: R18.2 U24.6(V-) U25.1
$1N1286: R17.1 R18.1 U24.1(ADJ)
$1N1536: R5.2 U10.6(V-) U13.1
$1N1537: R2.1 R5.1 U10.1(ADJ)
$1N1787: R11.2 U16.6(V-) U19.1
$1N1788: R8.1 R11.1 U16.1(ADJ)
$1N2038: R6.2 U11.6(V-) U14.1
$1N2039: R3.1 R6.1 U11.1(ADJ)
$1N2289: R12.2 U17.6(V-) U20.1
$1N2290: R9.1 R12.1 U17.1(ADJ)
$1N3001: C13.1 U21.5(SS)
$1N3002: R14.1 R16.2 U21.4(EN)
$2N762: C26.1 U26.5(SS)
$2N763: R19.1 R20.2 U26.4(EN)
$2N769: C25.2 U28.3(CFLY-)
$2N770: C25.1 U28.6(CFLY+)
$2N774: R21.1 U28.5(EN)
$2N1271: R22.1 U29.8(RG)
$2N1273: R22.2 U29.1(RG)
$2N1275: C43.1 R30.1 U29.3(+IN)
$2N1276: C43.2 R26.1 U29.2(–IN)
$2N1798: R23.1 U30.8(RG)
$2N1800: R23.2 U30.1(RG)
$2N1802: C44.1 R31.1 U30.3(+IN)
$2N1803: C44.2 R27.1 U30.2(–IN)
$2N2223: R24.1 U31.8(RG)
$2N2225: R24.2 U31.1(RG)
$2N2227: C45.1 R32.1 U31.3(+IN)
$2N2228: C45.2 R28.1 U31.2(–IN)
$2N2648: R25.1 U32.8(RG)
$2N2650: R25.2 U32.1(RG)
$2N2652: C46.1 R33.1 U32.3(+IN)
$2N2653: C46.2 R29.1 U32.2(–IN)
$2N3073: R34.1 U33.8(RG)
$2N3075: R34.2 U33.1(RG)
$2N3077: C63.1 R42.1 U33.3(+IN)
$2N3078: C63.2 R38.1 U33.2(–IN)
$2N3498: R35.1 U34.8(RG)
$2N3500: R35.2 U34.1(RG)
$2N3502: C64.1 R43.1 U34.3(+IN)
$2N3503: C64.2 R39.1 U34.2(–IN)
$2N3923: R36.1 U35.8(RG)
$2N3925: R36.2 U35.1(RG)
$2N3927: C65.1 R44.1 U35.3(+IN)
$2N3928: C65.2 R40.1 U35.2(–IN)
$2N4348: R37.1 U36.8(RG)
$2N4350: R37.2 U36.1(RG)
$2N4352: C66.1 R45.1 U36.3(+IN)
$2N4353: C66.2 R41.1 U36.2(–IN)

Not connected (* = marked no-connect by the designer): SCREW1 1*; SCREW2 1*; SCREW3 1*; SCREW4 1*; U9 2(NC/2)* 3(NC/4)* 5(NC/5)* 7(NC/3)* 8(NC)*; U10 2(NC/2)* 3(NC/4)* 5(NC/5)* 7(NC/3)* 8(NC)*; U11 2(NC/2)* 3(NC/4)* 5(NC/5)* 7(NC/3)* 8(NC)*; U15 2(NC/2)* 3(NC/4)* 5(NC/5)* 7(NC/3)* 8(NC)*; U16 2(NC/2)* 3(NC/4)* 5(NC/5)* 7(NC/3)* 8(NC)*; U17 2(NC/2)* 3(NC/4)* 5(NC/5)* 7(NC/3)* 8(NC)*; U22 2(NC/2)* 3(NC/4)* 5(NC/5)* 7(NC/3)* 8(NC)*; U24 2(NC/2)* 3(NC/4)* 5(NC/5)* 7(NC/3)* 8(NC)*
